# EAGLE design b3cape01 (EAGLE 4.16)

## Sheet 1 of 2
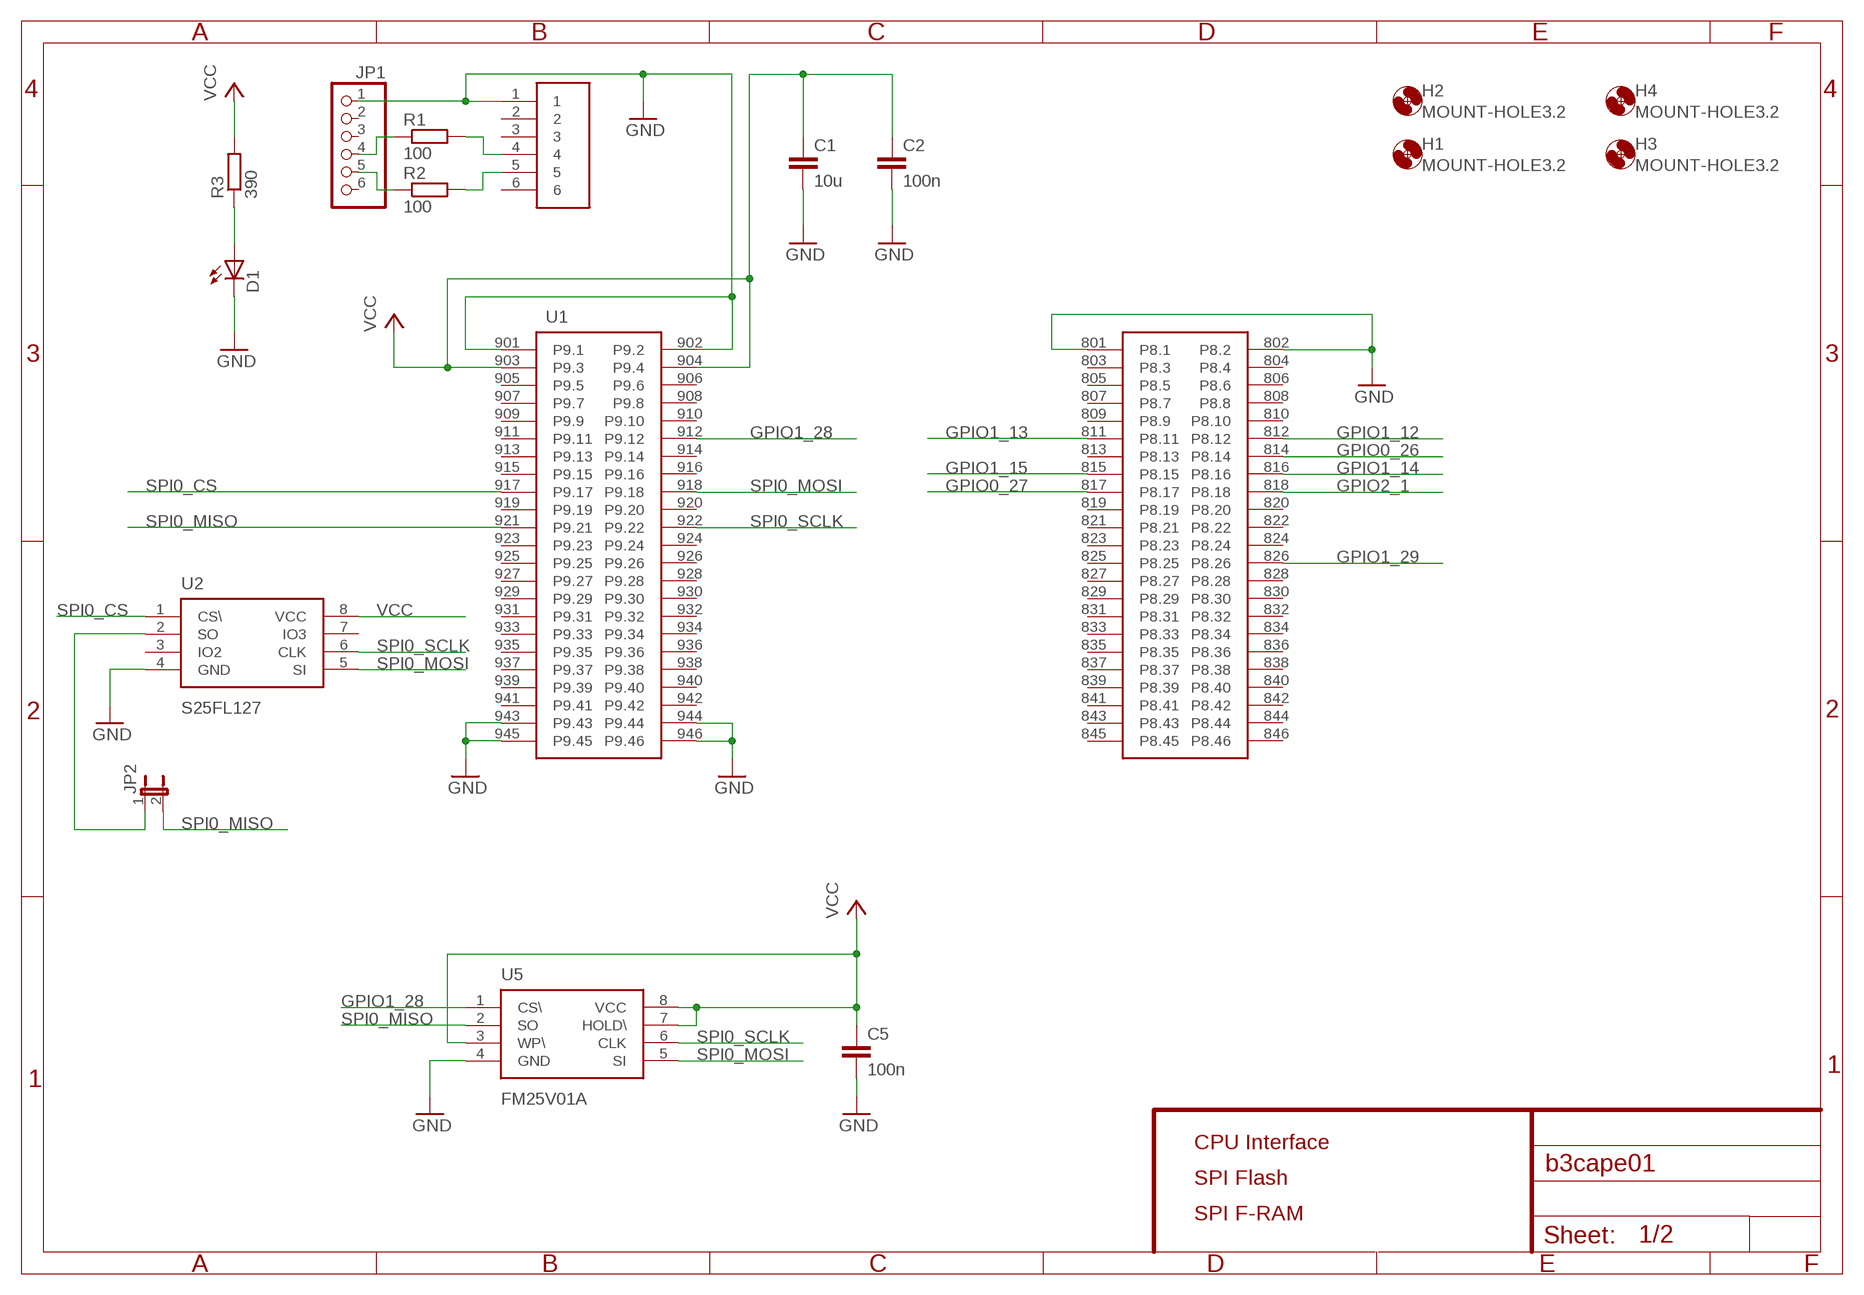
[diagram p0: schematic, sheet 1]

### Parts
C1  10u  C0805  [C0805]
C2  100n  C0805  [C0805]
C5  100n  C0805  [C0805]
D1  LED0805  [R0805]
H1  MOUNT-HOLE3.2  [3,2]
H2  MOUNT-HOLE3.2  [3,2]
H3  MOUNT-HOLE3.2  [3,2]
H4  MOUNT-HOLE3.2  [3,2]
JP1  PINHD-1X6  [1X06]
JP2  JP1E  [JP1]
R1  100  R0805  [R0805]
R2  100  R0805  [R0805]
R3  390  R0805  [R0805]
U1  B3S  [B3S]
U2  S25FL127  S25FLXXXXXXMXX10  [SO08W]
U5  FM25V01A  FM25CLXXX  [SO08]

### Nets
GND: C1.2 C2.2 C5.2 D1.2(C) JP1.1 U1.1 U1.801(P8.1) U1.802(P8.2) U1.901(P9.1) U1.902(P9.2) U1.943(P9.43) U1.944(P9.44) U1.945(P9.45) U1.946(P9.46) U2.4(GND) U5.4(GND) ; also sheet 2
GPIO0_26: U1.814(P8.14) ; also sheet 2
GPIO0_27: U1.817(P8.17) ; also sheet 2
GPIO1_12: U1.812(P8.12) ; also sheet 2
GPIO1_13: U1.811(P8.11) ; also sheet 2
GPIO1_14: U1.816(P8.16) ; also sheet 2
GPIO1_15: U1.815(P8.15) ; also sheet 2
GPIO1_28: U1.912(P9.12) U5.1(CS\)
GPIO1_29: U1.826(P8.26) ; also sheet 2
GPIO2_1: U1.818(P8.18) ; also sheet 2
N$1: JP2.1 U2.2(SO)
N$2: JP1.4 R1.1
N$3: JP1.5 R2.1
N$4: R1.2 U1.4
N$5: R2.2 U1.5
N$8: D1.1(A) R3.1
SPI0_CS: U1.917(P9.17) U2.1(CS\)
SPI0_MISO: JP2.2 U1.921(P9.21) U5.2(SO)
SPI0_MOSI: U1.918(P9.18) U2.5(SI) U5.5(SI)
SPI0_SCLK: U1.922(P9.22) U2.6(CLK) U5.6(CLK)
VCC: C1.1 C2.1 C5.1 R3.2 U1.903(P9.3) U1.904(P9.4) U2.8(VCC) U5.3(WP\) U5.7(HOLD\) U5.8(VCC) ; also sheet 2
Unconnected: JP1.2 JP1.3 JP1.6 U1.2 U1.3 U1.6 U1.803(P8.3) U1.804(P8.4) U1.805(P8.5) U1.806(P8.6) U1.807(P8.7) U1.808(P8.8) U1.809(P8.9) U1.810(P8.10) U1.813(P8.13) U1.819(P8.19) U1.820(P8.20) U1.821(P8.21) U1.822(P8.22) U1.823(P8.23) U1.824(P8.24) U1.825(P8.25) U1.827(P8.27) U1.828(P8.28) U1.829(P8.29) U1.830(P8.30) U1.831(P8.31) U1.832(P8.32) U1.833(P8.33) U1.834(P8.34) U1.835(P8.35) U1.836(P8.36) U1.837(P8.37) U1.838(P8.38) U1.839(P8.39) U1.840(P8.40) U1.841(P8.41) U1.842(P8.42) U1.843(P8.43) U1.844(P8.44) U1.845(P8.45) U1.846(P8.46) U1.905(P9.5) U1.906(P9.6) U1.907(P9.7) U1.908(P9.8) U1.909(P9.9) U1.910(P9.10) U1.911(P9.11) U1.913(P9.13) U1.914(P9.14) U1.915(P9.15) U1.916(P9.16) U1.919(P9.19) U1.920(P9.20) U1.923(P9.23) U1.924(P9.24) U1.925(P9.25) U1.926(P9.26) U1.927(P9.27) U1.928(P9.28) U1.929(P9.29) U1.930(P9.30) U1.931(P9.31) U1.932(P9.32) U1.933(P9.33) U1.934(P9.34) U1.935(P9.35) U1.936(P9.36) U1.937(P9.37) U1.938(P9.38) U1.939(P9.39) U1.940(P9.40) U1.941(P9.41) U1.942(P9.42) U2.3(IO2) U2.7(IO3)

### Notes on the sheet
- CPU Interface
- SPI Flash
- SPI F-RAM

## Sheet 2 of 2
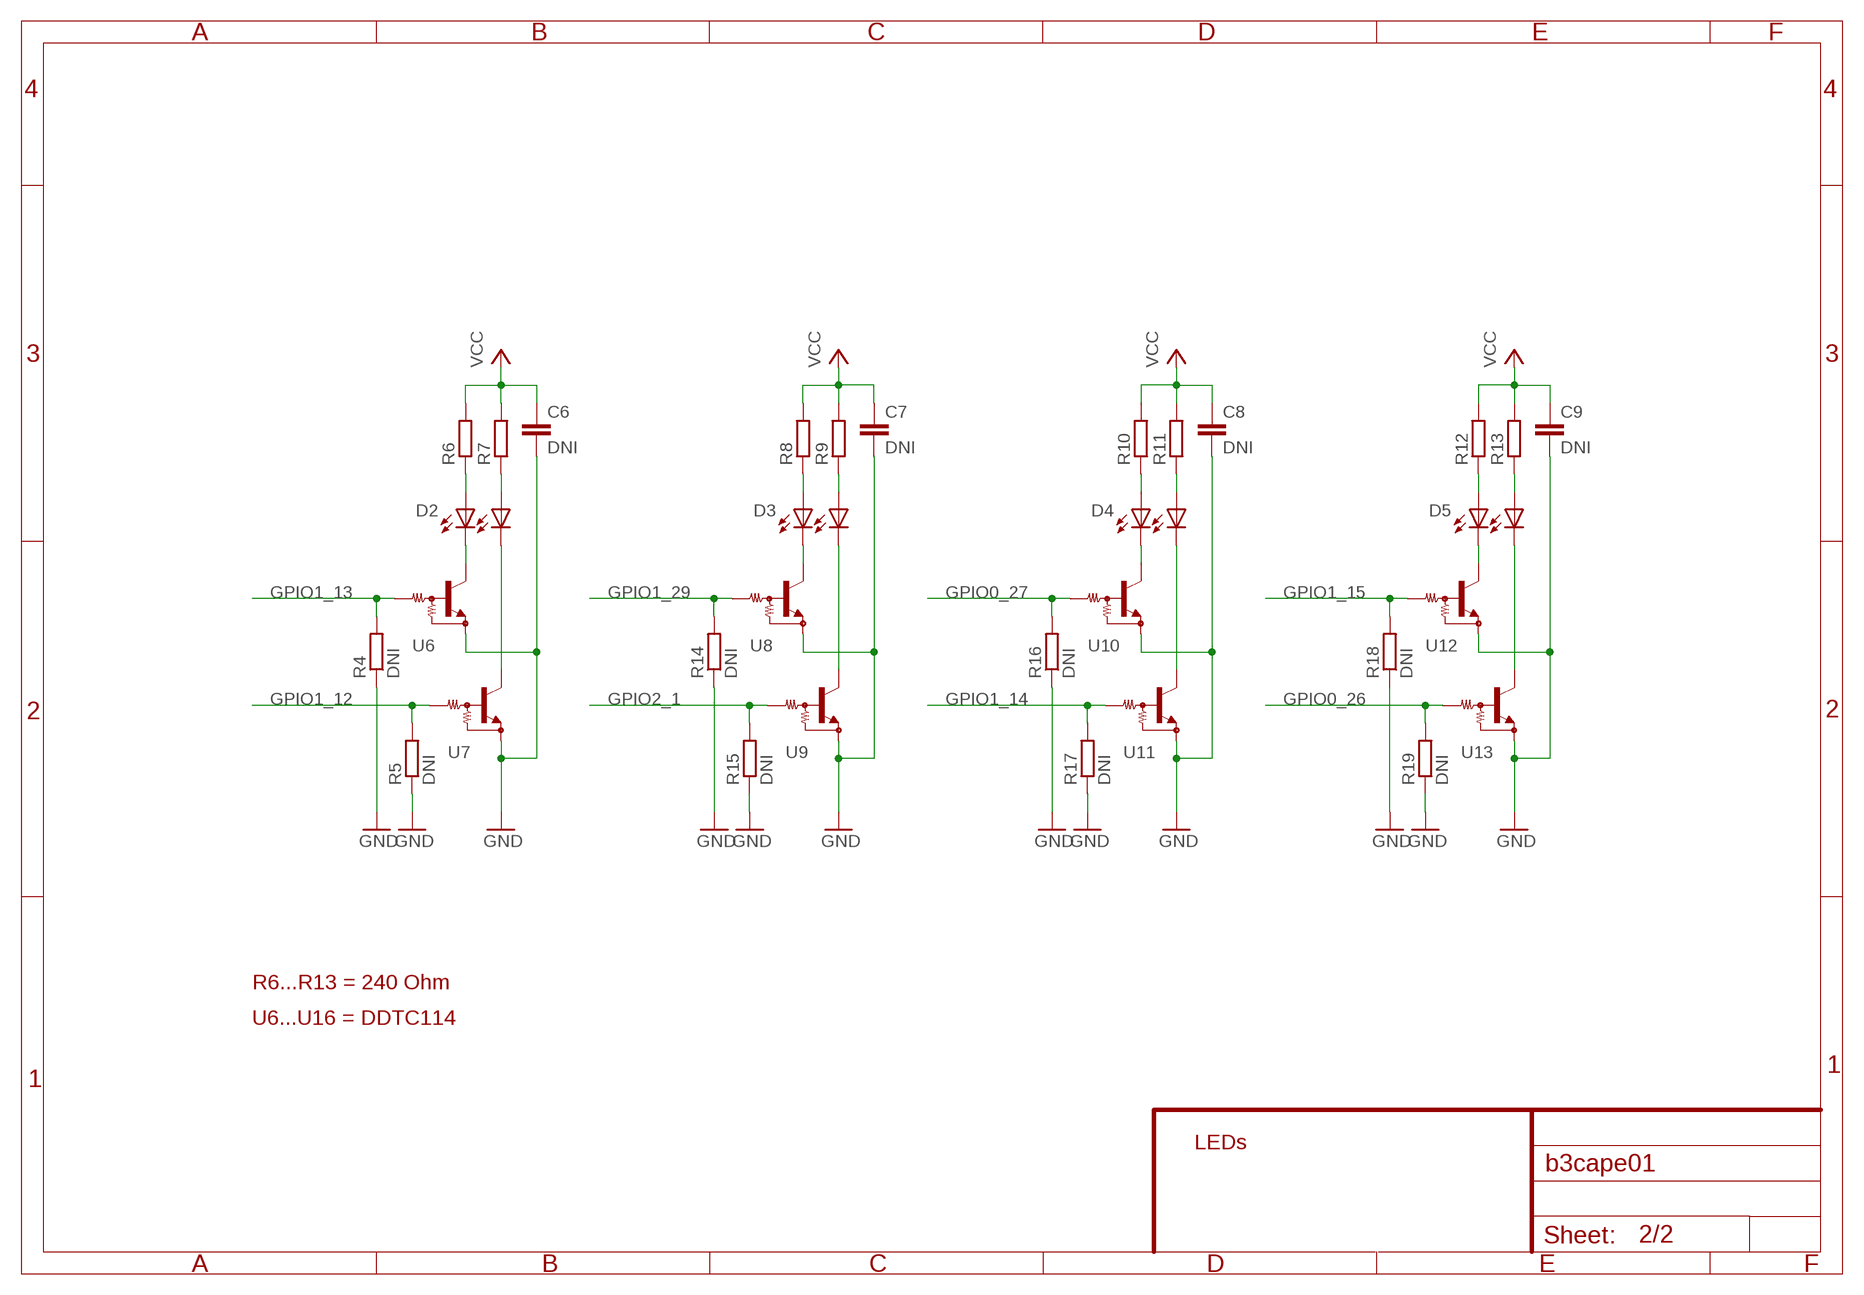
[diagram p1: schematic, sheet 2]

### Parts
C6  DNI  C0805  [C0805]
C7  DNI  C0805  [C0805]
C8  DNI  C0805  [C0805]
C9  DNI  C0805  [C0805]
D2  LED1210  [LED1210]
D3  LED1210  [LED1210]
D4  LED1210  [LED1210]
D5  LED1210  [LED1210]
R4  DNI  R0805  [R0805]
R5  DNI  R0805  [R0805]
R6  R0805  [R0805]
R7  R0805  [R0805]
R8  R0805  [R0805]
R9  R0805  [R0805]
R10  R0805  [R0805]
R11  R0805  [R0805]
R12  R0805  [R0805]
R13  R0805  [R0805]
R14  DNI  R0805  [R0805]
R15  DNI  R0805  [R0805]
R16  DNI  R0805  [R0805]
R17  DNI  R0805  [R0805]
R18  DNI  R0805  [R0805]
R19  DNI  R0805  [R0805]
U6  DDTC114  [SOT23]
U7  DDTC114  [SOT23]
U8  DDTC114  [SOT23]
U9  DDTC114  [SOT23]
U10  DDTC114  [SOT23]
U11  DDTC114  [SOT23]
U12  DDTC114  [SOT23]
U13  DDTC114  [SOT23]

### Nets
GND: C6.2 C7.2 C8.2 C9.2 R4.1 R5.1 R14.1 R15.1 R16.1 R17.1 R18.1 R19.1 U6.2(E) U7.2(E) U8.2(E) U9.2(E) U10.2(E) U11.2(E) U12.2(E) U13.2(E) ; also sheet 1
GPIO0_26: R19.2 U13.1(B) ; also sheet 1
GPIO0_27: R16.2 U10.1(B) ; also sheet 1
GPIO1_12: R5.2 U7.1(B) ; also sheet 1
GPIO1_13: R4.2 U6.1(B) ; also sheet 1
GPIO1_14: R17.2 U11.1(B) ; also sheet 1
GPIO1_15: R18.2 U12.1(B) ; also sheet 1
GPIO1_29: R14.2 U8.1(B) ; also sheet 1
GPIO2_1: R15.2 U9.1(B) ; also sheet 1
N$6: D2.P$3 R6.1
N$7: D2.P$4 R7.1
N$9: D2.P$2 U6.3(C)
N$10: D2.P$1 U7.3(C)
N$11: D3.P$3 R8.1
N$12: D3.P$4 R9.1
N$13: D3.P$2 U8.3(C)
N$14: D3.P$1 U9.3(C)
N$15: D4.P$3 R10.1
N$16: D4.P$4 R11.1
N$17: D4.P$2 U10.3(C)
N$18: D4.P$1 U11.3(C)
N$19: D5.P$3 R12.1
N$20: D5.P$4 R13.1
N$21: D5.P$2 U12.3(C)
N$22: D5.P$1 U13.3(C)
VCC: C6.1 C7.1 C8.1 C9.1 R6.2 R7.2 R8.2 R9.2 R10.2 R11.2 R12.2 R13.2 ; also sheet 1

### Notes on the sheet
- R6...R13 = 240 Ohm
- U6...U16 = DDTC114
- LEDs

## Library data of the parts
C1 C2 C5-C9 = emb4fun:C0805
D1 = emb4fun:LED0805
D2-D5 = emb4fun:LED1210
H1-H4 = holes:MOUNT-HOLE: MOUNTING HOLE with drill center marker
JP1 = pinhead:PINHD-1X6: PIN HEADER
JP2 = jumper:JP1E: JUMPER
R1-R19 = emb4fun:R0805
U1 = emb4fun:B3S
U2 = emb4fun:S25FLXXXXXXMXX10
U5 = emb4fun:FM25CLXXX
U6-U13 = emb4fun:DDTC114

## Board
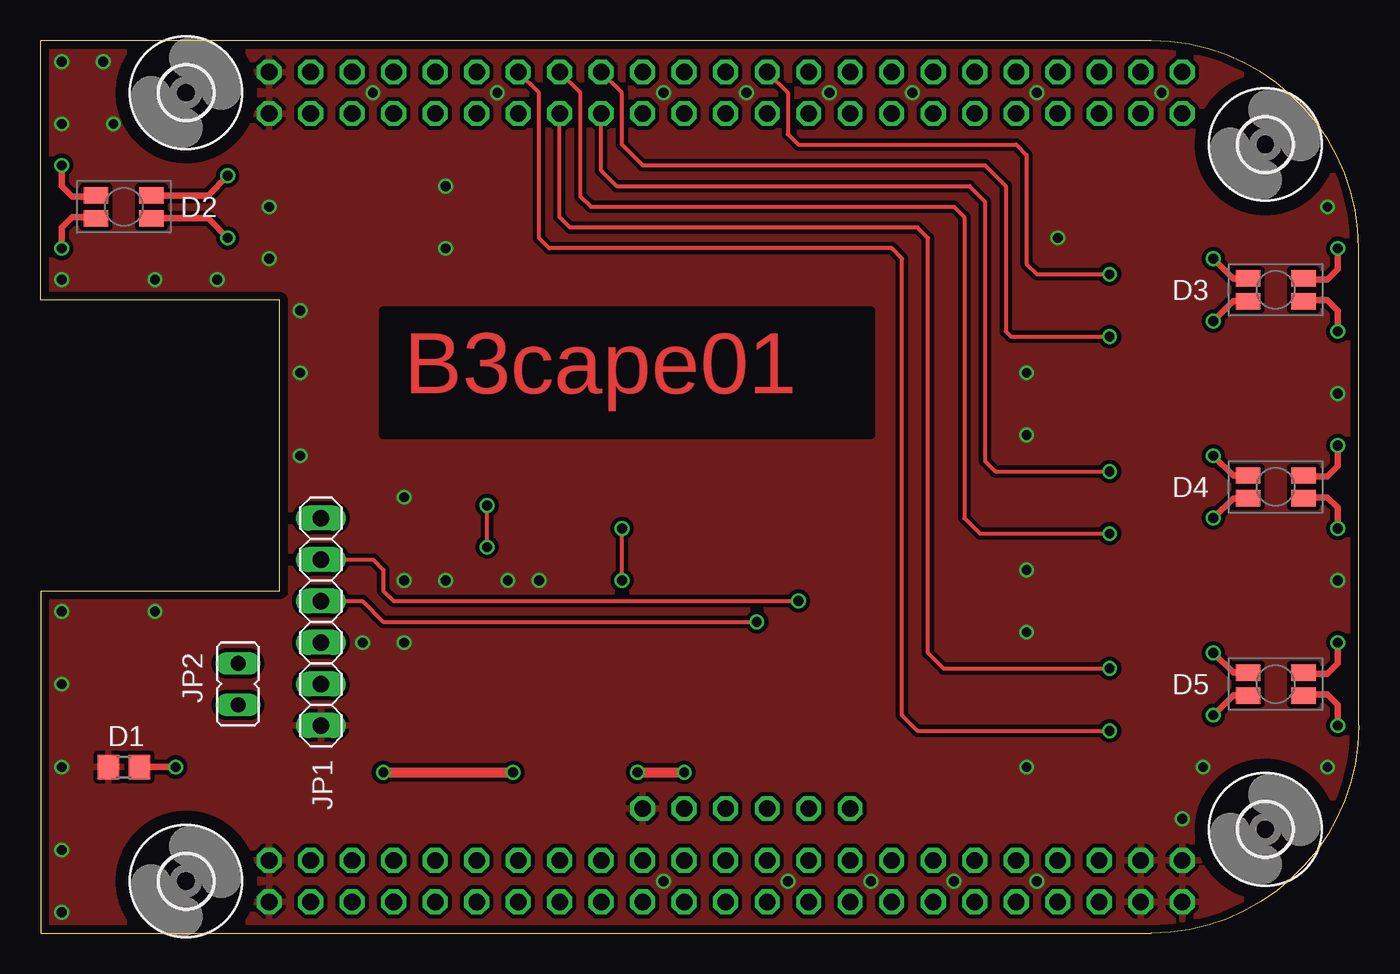
[diagram p2: board, top side]
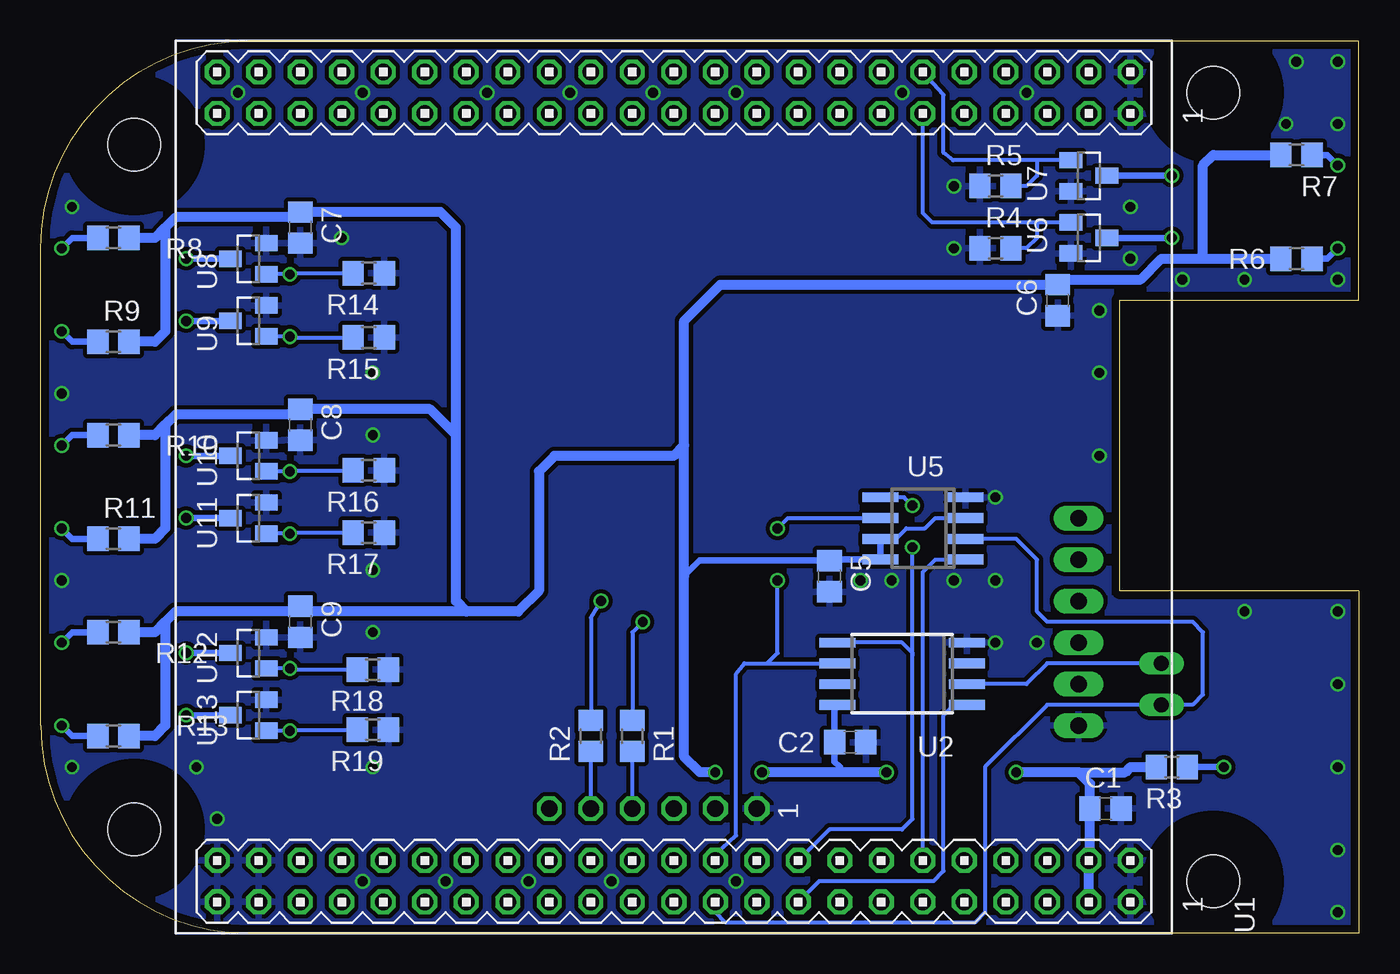
[diagram p3: board, bottom side, seen from below]

Size 80.64 x 54.61 mm. Coordinates in mm from the lower left corner, seen from the top.
Outline: 0,0 67.94,0 arc90 80.64,12.7 80.64,41.91 arc90 67.94,54.61 0,54.61 0,38.73 14.61,38.73 14.61,20.95 0,20.95 0,0
Copper layers (1*16): Top 0.035mm / dielectric 1.6mm / Bottom 0.035mm
Design rules "Elecrow_2-layer_PCB_eagle_rule": minimum track width 6mil, minimum drill 12mil, track to track 6mil, track to pad 6mil, pad to pad 6mil, via to via 8mil, smd to smd 0mil, copper to edge 20mil, drill to drill 10mil, minimum pad ring 6mil, minimum via ring 6mil, stop-mask expansion 0mil, vias tented up to drill 100mil, thermal gap 10mil
tRestrict: area 21,30.5 to 50.8,38.1

### Footprints (pad centres in the part's own frame; a part is rotated, then mirrored left to right if it is on the bottom)
C0805 = smd 1.3 x 1.5: 1 -0.95,0; 2 0.95,0
R0805 = smd 1.3 x 1.5: 1 -0.95,0; 2 0.95,0
LED1210 = smd 1.5 x 1: P$1 -1.7,-0.7; P$2 -1.7,0.7; P$3 1.7,0.7; P$4 1.7,-0.7
3,2 = hole 3.2: 0,0
1X06 = drill 1.016 long: 1 -6.35,0; 2 -3.81,0; 3 -1.27,0; 4 1.27,0; 5 3.81,0; 6 6.35,0
JP1 = drill 0.914 long: 1 0,-1.27; 2 0,1.27
B3S = drill 1.016 octagon: 1 -19.685,2.54; 2 -19.685,5.08; 3 -19.685,7.62; 4 -19.685,10.16; 5 -19.685,12.7; 6 -19.685,15.24; 801 22.86,-20.32; 802 25.4,-20.32; 803 22.86,-17.78; 804 25.4,-17.78; 805 22.86,-15.24; 806 25.4,-15.24; 807 22.86,-12.7; 808 25.4,-12.7; 809 22.86,-10.16; 810 25.4,-10.16; 811 22.86,-7.62; 812 25.4,-7.62; 813 22.86,-5.08; 814 25.4,-5.08; 815 22.86,-2.54; 816 25.4,-2.54; 817 22.86,0; 818 25.4,0; 819 22.86,2.54; 820 25.4,2.54; 821 22.86,5.08; 822 25.4,5.08; 823 22.86,7.62; 824 25.4,7.62; 825 22.86,10.16; 826 25.4,10.16; 827 22.86,12.7; 828 25.4,12.7; 829 22.86,15.24; 830 25.4,15.24; 831 22.86,17.78; 832 25.4,17.78; 833 22.86,20.32; 834 25.4,20.32; 835 22.86,22.86; 836 25.4,22.86; 837 22.86,25.4; 838 25.4,25.4; 839 22.86,27.94; 840 25.4,27.94; 841 22.86,30.48; 842 25.4,30.48; 843 22.86,33.02; 844 25.4,33.02; 845 22.86,35.56; 846 25.4,35.56; 901 -25.4,-20.32; 902 -22.86,-20.32; 903 -25.4,-17.78; 904 -22.86,-17.78; 905 -25.4,-15.24; 906 -22.86,-15.24; 907 -25.4,-12.7; 908 -22.86,-12.7; 909 -25.4,-10.16; 910 -22.86,-10.16; 911 -25.4,-7.62; 912 -22.86,-7.62; 913 -25.4,-5.08; 914 -22.86,-5.08; 915 -25.4,-2.54; 916 -22.86,-2.54; 917 -25.4,0; 918 -22.86,0; 919 -25.4,2.54; 920 -22.86,2.54; 921 -25.4,5.08; 922 -22.86,5.08; 923 -25.4,7.62; 924 -22.86,7.62; 925 -25.4,10.16; 926 -22.86,10.16; 927 -25.4,12.7; 928 -22.86,12.7; 929 -25.4,15.24; 930 -22.86,15.24; 931 -25.4,17.78; 932 -22.86,17.78; 933 -25.4,20.32; 934 -22.86,20.32; 935 -25.4,22.86; 936 -22.86,22.86; 937 -25.4,25.4; 938 -22.86,25.4; 939 -25.4,27.94; 940 -22.86,27.94; 941 -25.4,30.48; 942 -22.86,30.48; 943 -25.4,33.02; 944 -22.86,33.02; 945 -25.4,35.56; 946 -22.86,35.56
SO08W = smd 0.6 x 2.2: 1 -1.905,-3.965; 2 -0.635,-3.965; 3 0.635,-3.965; 4 1.905,-3.965; 5 1.905,3.965; 6 0.635,3.965; 7 -0.635,3.965; 8 -1.905,3.965
SO08 = smd 0.6 x 2.2: 1 -1.905,-2.6; 2 -0.635,-2.6; 3 0.635,-2.6; 4 1.905,-2.6; 5 1.905,2.6; 6 0.635,2.6; 7 -0.635,2.6; 8 -1.905,2.6
SOT23 = smd 1 x 1.4: 1 -0.95,-1.1; 2 0.95,-1.1; 3 0,1.1

### Placement (x,y rotation side)
C1  15.49,7.62 0 bottom
C2  31.11,11.68 0 bottom
C5  32.38,21.84 270 bottom
C6  18.41,38.73 270 bottom
C7  64.77,43.18 270 bottom
C8  64.77,31.11 270 bottom
C9  64.77,19.05 270 bottom
D1  5.08,10.16 180 top
D2  5.08,44.45 180 top
D3  75.56,39.37 0 top
D4  75.56,27.3 0 top
D5  75.56,15.24 0 top
H1  8.89,3.17 0 top
H2  8.89,51.44 0 top
H3  74.93,48.26 0 top
H4  74.93,6.35 0 top
JP1  17.14,19.05 90 top
JP2  12.06,15.24 180 top
R1  44.45,12.06 270 bottom
R2  46.99,12.06 270 bottom
R3  11.43,10.16 180 bottom
R4  22.23,41.91 0 bottom
R5  22.23,45.72 0 bottom
R6  3.81,41.27 180 bottom
R7  3.81,47.62 180 bottom
R8  76.2,42.55 0 bottom
R9  76.2,36.2 0 bottom
R10  76.2,30.48 0 bottom
R11  76.2,24.13 0 bottom
R12  76.2,18.41 0 bottom
R13  76.2,12.06 0 bottom
R14  60.58,40.39 180 bottom
R15  60.58,36.45 180 bottom
R16  60.58,28.32 180 bottom
R17  60.58,24.51 180 bottom
R18  60.33,16.13 180 bottom
R19  60.33,12.45 180 bottom
U1  34.29,27.3 90 bottom
U2  27.94,15.88 90 bottom
U5  26.67,24.77 90 bottom
U6  16.51,42.55 270 bottom
U7  16.51,46.35 270 bottom
U8  67.94,41.27 90 bottom
U9  67.94,37.47 90 bottom
U10  67.94,29.21 90 bottom
U11  67.94,25.4 90 bottom
U12  67.94,17.14 90 bottom
U13  67.94,13.34 90 bottom

### Tracks (layer width: path | path; a pad name or v marks a point on that pad's centre or on a via)
GND  (via drill 0.6)
  other vias: 3.81,53.34 1.27,53.34 1.27,49.53 1.27,40.01 10.79,40.01 15.88,38.1 15.88,34.29 15.88,29.21 13.97,44.45 13.97,41.27 78.74,44.45 78.74,10.16 71.12,10.16 69.85,6.99 68.58,51.44 48.26,51.44 53.34,51.44 60.96,51.44 20.32,51.44 27.94,51.44 38.1,51.44 43.18,51.44 50.8,3.17 55.88,3.17 60.96,3.17 38.1,3.17 45.72,3.17 4.45,49.53 6.99,40.01 22.23,17.78 19.68,17.78 22.23,21.59 24.77,21.59 28.57,21.59 30.48,21.59 22.23,26.67 6.99,19.68 1.27,19.68 1.27,15.24 1.27,1.27 1.27,5.08 1.27,10.16 24.77,45.72 24.77,41.91 79.38,33.02 79.38,21.59 62.23,42.55 60.33,34.29 60.33,30.48 60.33,22.23 60.33,18.41 60.33,10.16
  pour Bottom (isolate 0.254): -2.54,-2.54 -2.54,58.42 83.82,58.42 83.82,-2.54
  pour Top (isolate 0.254): -5.08,60.96 86.36,60.96 86.36,-5.08 -5.08,-5.08
GPIO0_26  (via drill 0.6)
  Top 0.254: v65.41,12.38 53.66,12.38 52.7,13.34 52.7,41.27 52.07,41.91 31.11,41.91 30.48,42.55 30.48,51.44 U1.814
  Bottom 0.254: U13.1 v65.41,12.38 65.47,12.38 65.53,12.45 R19.2
GPIO0_27  (via drill 0.6)
  Top 0.254: v65.41,28.26 58.42,28.26 57.78,28.89 57.78,44.77 56.83,45.72 35.24,45.72 34.29,46.67 U1.817
  Bottom 0.254: U10.1 v65.41,28.26 65.47,28.26 | 65.47,28.26 65.53,28.19 | R16.2 65.41,28.32 65.47,28.26
GPIO1_12
  Bottom 0.254: U7.1 19.68,47.3 | 19.68,47.3 24.83,47.3 25.4,47.75 25.4,51.31 U1.812 | R5.2 20.32,45.72 19.68,46.35 19.68,47.3
GPIO1_13
  Bottom 0.254: U6.1 19.68,43.49 | 19.68,43.49 26.1,43.49 26.67,44.07 U1.811 | R4.2 20.32,41.91 19.68,42.55 19.68,43.49
GPIO1_14  (via drill 0.6)
  Top 0.254: v65.41,24.45 57.47,24.45 56.52,25.4 56.52,43.81 55.88,44.45 33.66,44.45 33.02,45.09 33.02,51.44 U1.816
  Bottom 0.254: U11.1 v65.41,24.45 65.41,24.38 65.28,24.51 R17.2
GPIO1_15  (via drill 0.6)
  Top 0.254: v65.41,16.19 55.24,16.19 54.29,17.14 54.29,42.55 53.66,43.18 32.38,43.18 31.75,43.81 U1.815
  Bottom 0.254: U12.1 v65.41,16.2 v65.41,16.19 65.41,16 65.28,16.13 R18.2
GPIO1_28
  Bottom 0.254: U1.912 26.67,22.1 25.91,22.86 U5.1 24,22.86
GPIO1_29  (via drill 0.6)
  Top 0.254: v65.41,40.32 60.96,40.32 60.33,40.96 60.33,47.62 59.69,48.26 46.35,48.26 45.72,48.9 45.72,51.44 U1.826
  Bottom 0.254: U8.1 v65.41,40.33 v65.41,40.32 65.41,40.26 | 65.41,40.26 65.53,40.13 | R14.2 65.28,40.39 65.41,40.26
GPIO2_1  (via drill 0.6)
  Top 0.254: v65.41,36.51 59.37,36.51 59.05,36.83 59.05,45.72 57.78,46.99 36.83,46.99 35.56,48.26 35.56,51.44 U1.818
  Bottom 0.254: U9.1 v65.41,36.52 v65.41,36.51 65.41,36.45 R15.2
N$1
  Bottom 0.254: JP2.1 19.05,16.51 20.32,15.24 U2.2 23.5,15.24
N$2  (via drill 0.6)
  Top 0.254: v43.81,19.05 20.95,19.05 19.68,20.32 JP1.4
  Bottom 0.254: R1.1 44.45,18.41 v43.81,19.05
N$3  (via drill 0.6)
  Top 0.254: v46.35,20.32 21.59,20.32 20.95,20.95 20.95,22.23 20.32,22.86 JP1.5
  Bottom 0.254: R2.1 46.99,19.3 v46.35,20.32
N$4
  Bottom 0.254: U1.4 R1.2
N$5
  Bottom 0.254: U1.5 R2.2
N$6  (via drill 0.6)
  Top 0.406: v1.27,41.91 1.27,43.18 1.91,43.81 3.17,43.81 3.24,43.75 D2.P$3
  Bottom 0.406: R6.1 1.91,41.27 v1.27,41.91
N$7  (via drill 0.6)
  Top 0.406: v1.27,46.99 1.27,45.72 1.91,45.09 3.17,45.09 3.24,45.15 D2.P$4
  Bottom 0.406: R7.1 1.91,47.62 v1.27,46.99
N$8  (via drill 0.6)
  Top 0.406: 5.71,10.16 D1.1 v8.26,10.16
  Bottom 0.406: v8.26,10.16 R3.1
N$9  (via drill 0.6)
  Top 0.406: D2.P$2 10.22,43.75 v11.43,42.55
  Bottom 0.406: v11.43,42.55 U6.3
N$10  (via drill 0.6)
  Top 0.406: D2.P$1 10.22,45.15 v11.43,46.35
  Bottom 0.406: v11.43,46.35 U7.3
N$11  (via drill 0.6)
  Top 0.406: v79.38,41.91 79.38,40.64 78.74,40.01 77.47,40.01 77.41,40.07 D3.P$3
  Bottom 0.406: R8.1 78.74,42.55 v79.38,41.91
N$12  (via drill 0.6)
  Top 0.406: v79.38,36.83 79.38,38.1 78.74,38.73 77.47,38.73 77.41,38.67 D3.P$4
  Bottom 0.406: R9.1 78.74,36.2 v79.38,36.83
N$13  (via drill 0.6)
  Top 0.406: D3.P$2 72.96,40.07 v71.75,41.27
  Bottom 0.406: U8.3 v71.75,41.27
N$14  (via drill 0.6)
  Top 0.406: D3.P$1 72.96,38.67 v71.75,37.47
  Bottom 0.406: U9.3 v71.75,37.47
N$15  (via drill 0.6)
  Top 0.406: v79.38,29.84 79.38,28.57 78.74,27.94 77.47,27.94 77.41,28 D4.P$3
  Bottom 0.406: R10.1 78.74,30.48 v79.38,29.84
N$16  (via drill 0.6)
  Top 0.406: v79.38,24.77 79.38,26.04 78.74,26.67 77.47,26.67 77.41,26.61 D4.P$4
  Bottom 0.406: R11.1 78.74,24.13 v79.38,24.77
N$17  (via drill 0.6)
  Top 0.406: D4.P$2 72.96,28 v71.75,29.21
  Bottom 0.406: U10.3 v71.75,29.21
N$18  (via drill 0.6)
  Top 0.406: D4.P$1 72.96,26.61 v71.75,25.4
  Bottom 0.406: U11.3 v71.75,25.4
N$19  (via drill 0.6)
  Top 0.406: v79.38,17.78 79.38,16.51 78.74,15.88 77.47,15.88 77.41,15.94 D5.P$3
  Bottom 0.406: R12.1 78.74,18.41 v79.38,17.78
N$20  (via drill 0.6)
  Top 0.406: v79.38,12.7 79.38,13.97 78.74,14.61 77.47,14.61 77.41,14.54 D5.P$4
  Bottom 0.406: R13.1 78.74,12.06 v79.38,12.7
N$21  (via drill 0.6)
  Top 0.406: D5.P$2 72.96,15.94 v71.75,17.14
  Bottom 0.406: U12.3 v71.75,17.14
N$22  (via drill 0.6)
  Top 0.406: D5.P$1 72.96,14.54 v71.75,13.34
  Bottom 0.406: U13.3 v71.75,13.34
SPI0_CS
  Bottom 0.254: U2.1 24.77,13.97 25.4,13.34 25.4,3.81 26.04,3.17 33.02,3.17 U1.917
SPI0_MISO
  Bottom 0.254: U1.921 39.37,1.27 38.73,0.64 23.5,0.64 22.86,1.27 22.86,10.16 19.05,13.97 JP2.2 10.16,13.97 9.53,14.61 9.53,18.41 10.16,19.05 19.05,19.05 19.68,19.68 19.68,22.86 20.95,24.13 U5.2
SPI0_MOSI  (via drill 0.6)
  Top 0.254: v27.3,23.62 v27.3,26.16
  Bottom 0.254: U1.918 32.38,6.35 27.94,6.35 27.3,6.99 27.3,17.02 | 27.3,17.02 27.3,17.14 27.94,17.78 U2.5 | U5.5 27.81,26.67 v27.3,26.16 | 27.3,17.02 v27.3,23.62
SPI0_SCLK  (via drill 0.6)
  Top 0.254: v35.56,21.59 v35.56,24.77
  Bottom 0.254: U1.922 39.37,4.83 38.1,5.97 38.1,15.88 37.59,16.51 36.2,16.51 | 32.51,16.51 U2.6 36.2,16.51 | U5.6 34.92,25.4 v35.56,24.77 | v35.56,21.59 35.56,17.14 36.2,16.51
VCC  (via drill 0.6)
  Top 0.61: v20.95,9.84 v28.89,9.84 | v36.51,9.84 v39.37,9.84
  Bottom 0.254: C5.1 32.38,22.86 | U5.7 28.32,24.13 27.69,24.77 26.54,24.77 25.91,25.4 U5.3
  Bottom 0.406: C6.1 18.41,40.01 | 64.77,19.68 C9.1 | 73.66,18.41 73.98,18.41 | 73.66,30.48 73.98,30.48 | U1.904 16.44,4.51 | C8.1 | C7.1 65.09,43.81 | 73.66,42.55 73.98,42.55 | U2.8 31.75,13.97 32.06,13.65 C2.1 32.06,10.47 31.75,10.16 31.75,9.84 | 32.38,22.86 U5.8 29.21,22.86 29.27,22.92 U5.7 | C5.1 40.33,22.79 41.27,21.84
  Bottom 0.61: U1.903 U1.904 16.64,4.57 | 9.53,41.27 12.06,41.27 13.34,40.01 18.41,40.01 | 73.03,19.05 73.03,12.7 73.66,12.06 R13.2 | 73.03,19.05 72.39,19.68 64.77,19.68 54.61,19.68 | 73.03,19.05 73.66,18.41 R12.2 | 73.03,31.11 73.03,24.77 73.66,24.13 R11.2 | 73.03,31.11 72.39,31.75 65.09,31.75 C8.1 56.83,32.07 55.24,30.48 | 73.03,31.11 73.66,30.48 R10.2 | 16.44,4.51 C1.1 16.44,9.14 17.14,9.84 | 17.14,9.84 v20.95,9.84 | v28.89,9.84 31.75,9.84 v36.51,9.84 | C6.1 39.05,39.69 41.27,37.47 41.27,29.84 | 41.27,29.84 41.27,21.84 41.27,10.79 40.32,9.84 v39.37,9.84 | 54.61,19.68 51.44,19.68 50.16,20.95 50.16,28.26 49.21,29.21 41.91,29.21 41.27,29.84 | 55.24,30.48 55.24,20.32 54.61,19.68 | C7.1 56.2,44.13 55.24,43.18 55.24,30.48 | 73.03,43.18 73.03,36.83 73.66,36.2 R9.2 | 73.03,43.18 72.39,43.81 65.09,43.81 | 73.03,43.18 73.66,42.55 R8.2 | 9.53,41.27 9.53,46.99 8.89,47.62 R7.2 4.45,47.62 | 17.14,9.84 14.29,9.84 13.97,10.16 R3.2 | 4.45,41.27 R6.2 9.53,41.27

### Text on the board
Top: B3cape01